# EasyEDA Pro project ByByte_nano.epro, board PCB1
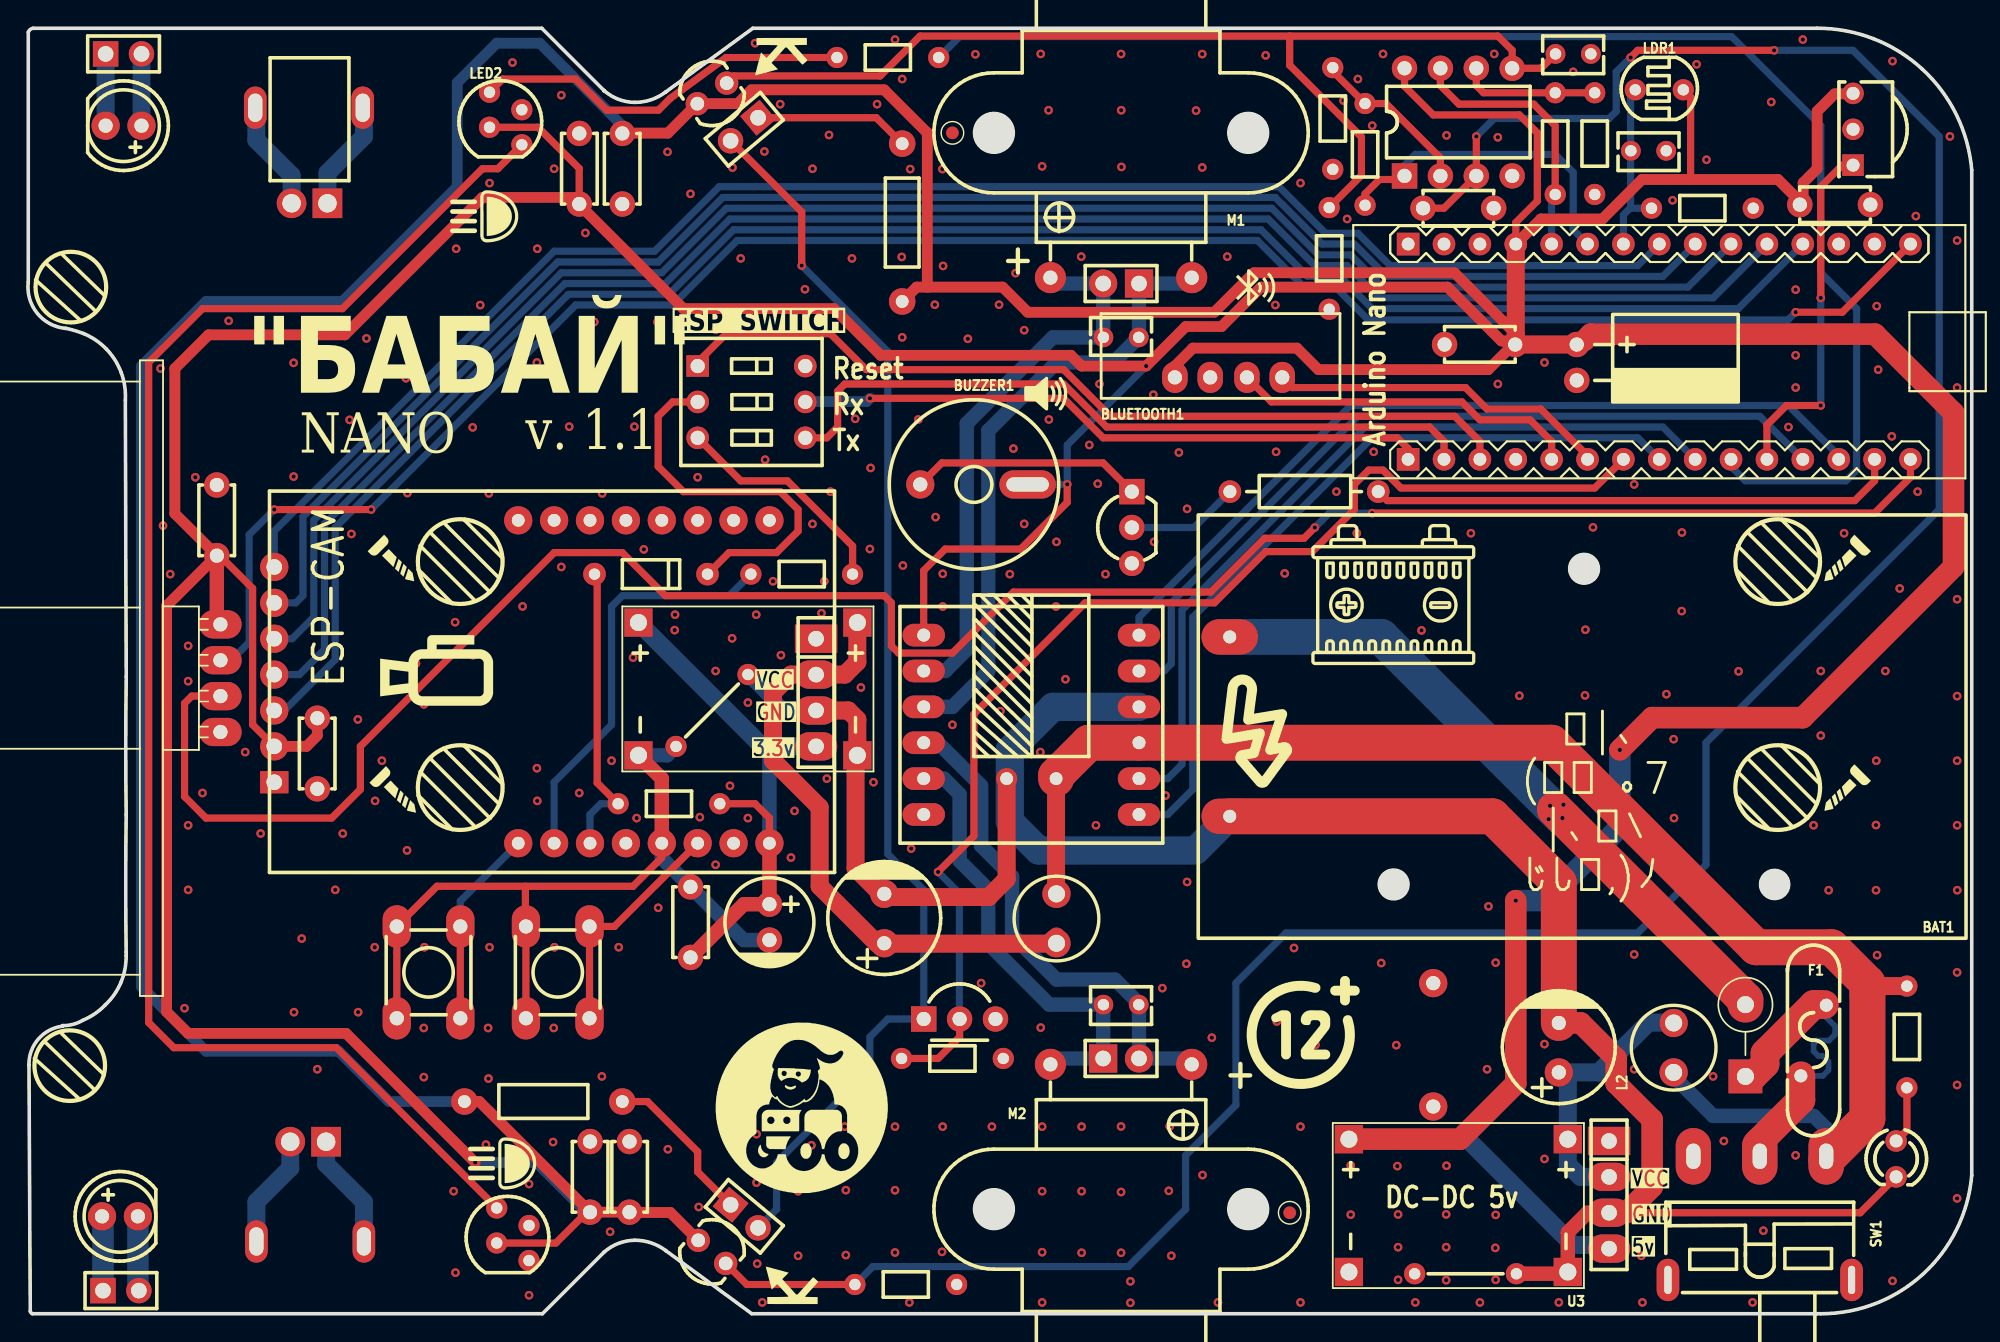
[diagram p2: board, top side]
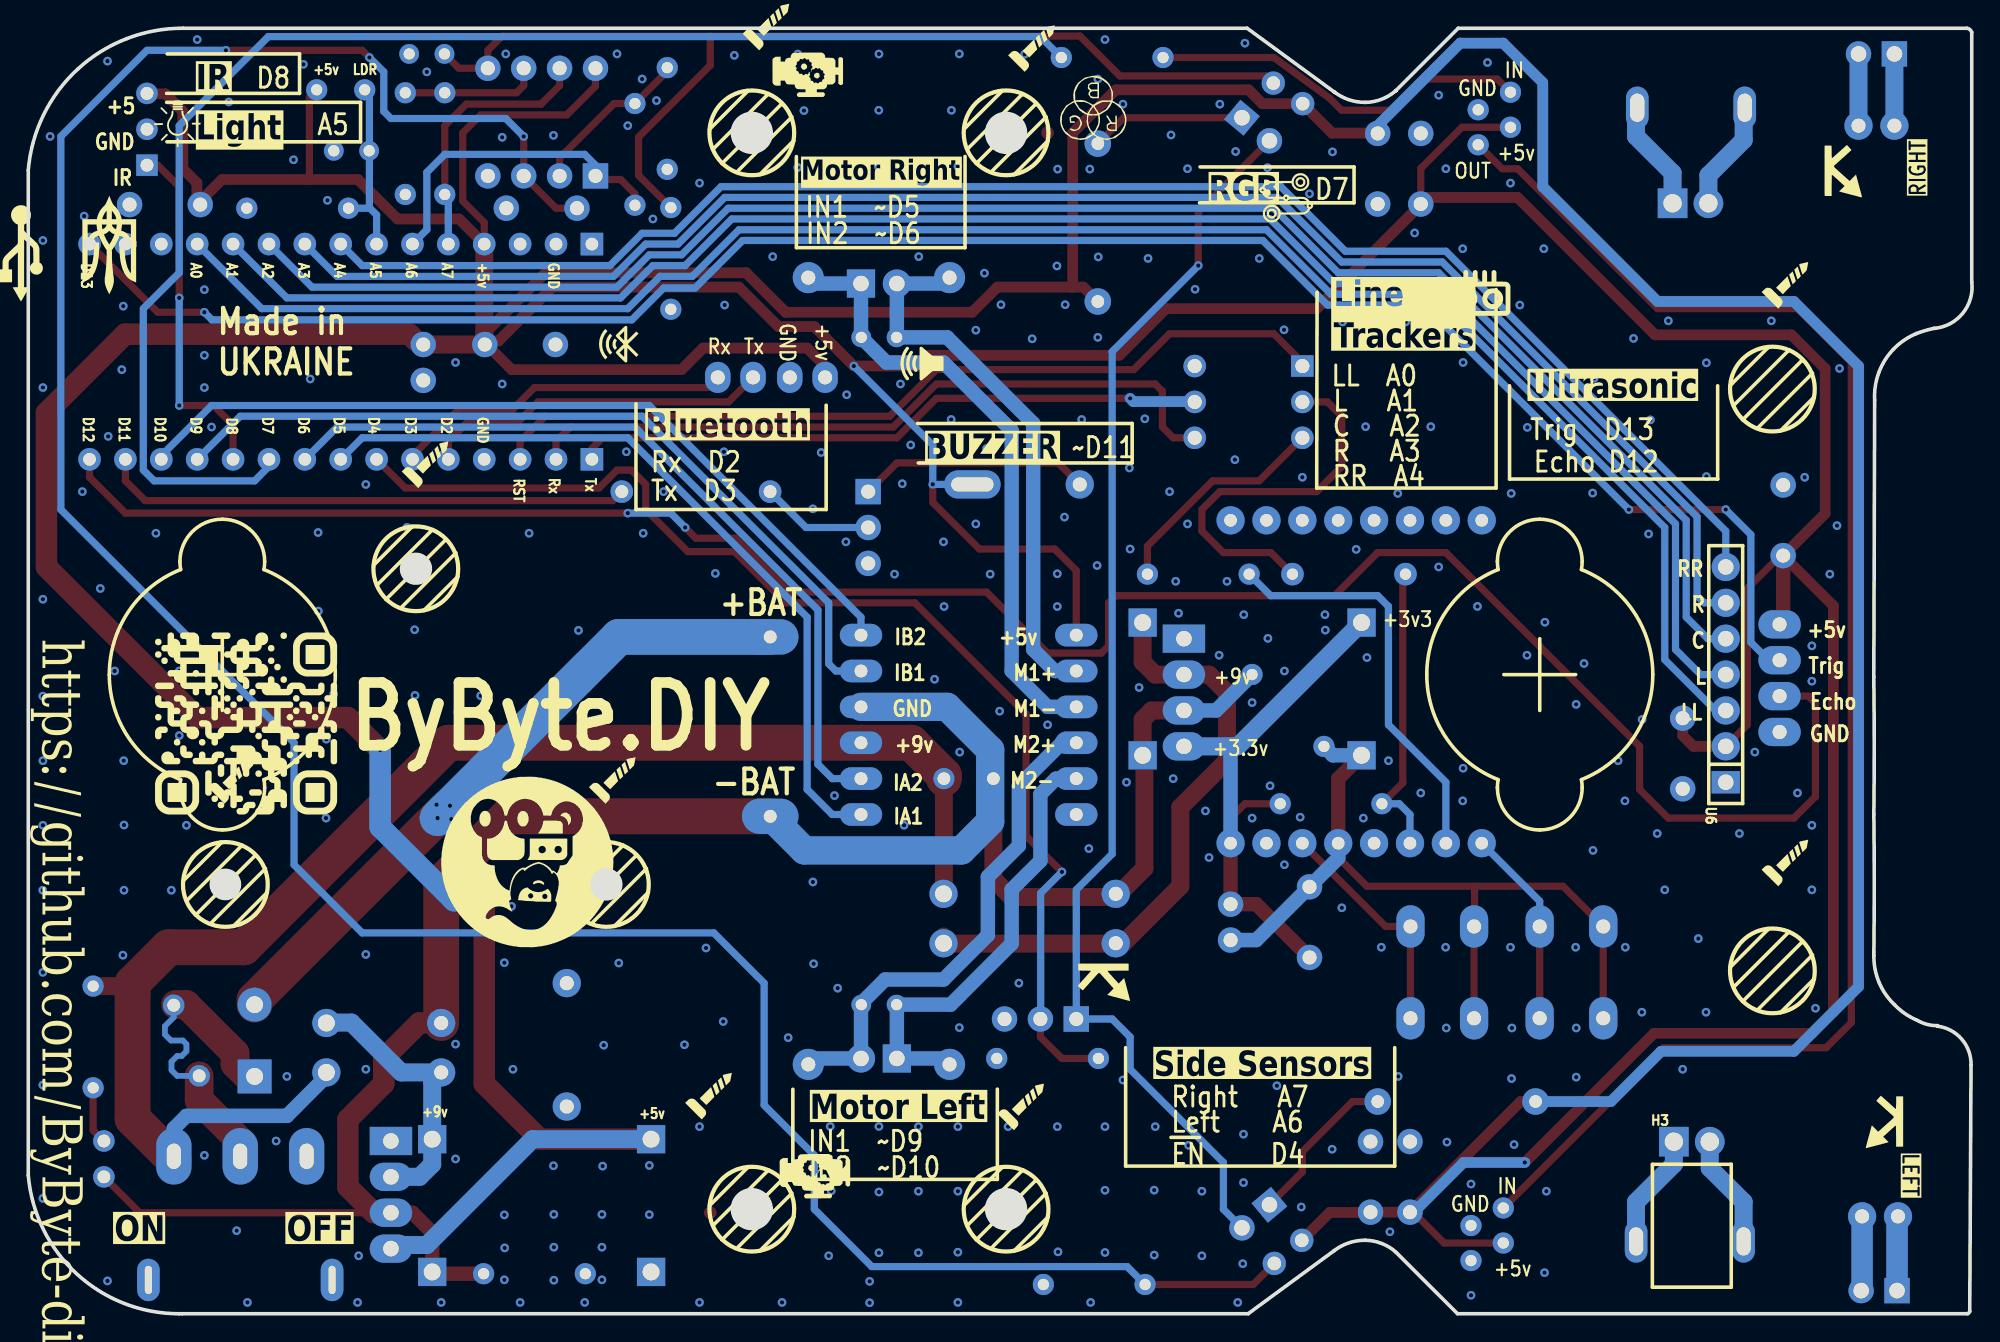
[diagram p3: board, bottom side, seen from below]

Outline 137.58 x 91.01 mm; copper layers: Top Layer, Bottom Layer. Coordinates in mm from the lower left corner of the outline.
Outline path: 40.76,86.6 40.78,86.58 arc(40.76,86.57) 40.76,86.6 ; 40.76,86.6 36.35,91.01 0.34,91.01 arc(0.13,90.91) 0,90.72 0,73.04 arc(0.62,70.85) 2.62,69.76 2.68,69.76 arc(3.31,69.6) 3.93,69.39 arc(4.79,68.92) 5.54,68.29 arc(6.15,67.51) 6.58,66.63 arc(6.83,65.67) 6.87,64.69 6.93,45.09 arc(6.91,40.22) 6.93,35.35 arc(6.9,30.48) 6.93,25.61 6.93,25.37 arc(6.85,24.4) 6.56,23.47 arc(6.1,22.61) 5.46,21.88 arc(4.71,21.24) 3.85,20.77 arc(3.16,20.49) 2.42,20.4 2.43,20.36 arc(0.71,19.44) 0.05,17.61 0.14,0.17 arc(0.2,0.07) 0.29,0 36.4,0 40.77,4.37 arc(41.77,4.98) 42.93,5.2 arc(44.09,5.02) 45.13,4.47 45.13,4.47 51.22,0 126.66,0 arc(126.78,0) 126.89,0 arc(134.14,2.82) 137.58,9.8 137.58,80.97 arc(136.49,84.88) 134.06,88.13 arc(132.44,89.36) 130.61,90.27 arc(128.65,90.83) 126.62,91.01 51.29,91.01 45.12,86.49 45.13,86.5 arc(44.08,85.95) 42.92,85.76 arc(41.77,85.99) 40.76,86.6
Stack: Top Layer 0.035mm / Dielectric1 1.51mm FR4 er 4.5 / Bottom Layer 0.035mm

## Design rules (mm)
template: JLCPCB Capability(Two Layers Board)
spacing copperThickness1oz (default): track to track 0.102, other pairs 0.152 to 0.3
spacing copperThickness2oz: track to track 0.203, other pairs 0.152 to 0.3
track width copperThickness1oz (default): min 0.127, default 0.254, max 2.54
track width copperThickness2oz: min 0.203, default 0.254, max 2.54
differential pair differentialPair (default): width min 0.127, default 0.254, max 2.54; gap min 0.152, default 0.152
via viaSize (default): diameter min 0.5, default 0.61, max 10; hole min 0.3, default 0.305, max 6.3

## Placement (name value [footprint] x y rotation side)
BAT1  -  [9V BATTERY]  109.87 41.95 180 top
BLUETOOTH1  -  [HC06]  92.85 64.81 180 top
BUZZER1  buzzer-12X9  [BUZ-TH_BD12.0-P7.60-D0.6-FD]  66.94 58.71 180 top
C1  470uF  [CAP-TH_BD8.0-P3.50-D0.6-FD-2#2]  60.59 27.98 90 top
C2  0.1u  [CAP-TH_L5.0-W2.5-P5.00-D1.0]  46.88 27.73 90 top
C3  470uF  [CAP-TH_BD6.3-P2.50-D1.0-FD]  52.47 27.73 270 top
C4  470uF  [CAP-TH_BD8.0-P3.50-D0.6-FD-2]  108.35 18.84 90 top
C5  470uF  [CAP-TH_BD6.3-P2.50-D1.0-FD]  109.62 67.35 270 top
C6  1u  [CAP-TH_L5.0-W2.5-P5.00-D1.0]  102.76 68.62 180 top
C7  1u  [CAP-TH_L5.0-W2.5-P5.00-D1.0]  42.05 81.07 270 top
C8  0.1u  [CAP-TH_L4.0-W2.5-P2.50-D0.5]  109.36 89.19 0 top
C9  1u  [CAP-TH_L5.0-W2.5-P5.00-D1.0]  42.56 9.69 90 top
C10  0.1u  [CAP-TH_L5.0-W2.5-P5.00-D1.0]  101.23 78.27 0 top
C11  1u  [CAP-TH_L5.0-W2.5-P5.00-D1.0]  13.35 56.17 270 top
C12  1u  [CAP-TH_L5.0-W2.5-P5.00-D1.0]  20.46 39.66 270 top
C13  1u  [CAP-TH_L5.0-W2.5-P5.00-D1.0]  39 81.07 90 top
C14  1u  [CAP-TH_L5.0-W2.5-P5.00-D1.0]  39.77 9.69 90 top
C15  10n  [CAP-TH_L4.0-W2.5-P2.50-D0.5]  77.36 69.13 180 top
C16  10n  [CAP-TH_L4.0-W2.5-P2.50-D0.5]  77.36 21.88 0 top
C17  470uF  [CAP-TH_BD8.0-L11.5-P3.50-D0.60]  71.01 37.89 90 top
C18  1u  [CAP-TH_L5.0-W2.5-P5.00-D1.0]  127.9 78.53 0 top
C19  0.1u  [CAP-TH_L4.0-W2.5-P2.50-D0.5]  114.7 82.34 0 top
D1  SFH4545  [LED-TH_BD5.0-P2.54-FD]  6.75 84.11 180 top
D2  SFH4545  [LED-TH_BD5.0-P2.54-FD]  6.49 6.9 0 top
D3  1N4148  [DO-35_BD2.0-L4.0-P8.0-D0.5-RD]  44.08 52.36 180 top
D4  1N5822  [Diode_THT:D_DO-15_P5.08mm_Vertical_KathodeUp]  121.55 16.8 90 top
F1  TRF250-1000  [FUSE-TH_L13.5-W3.7-P5.00-D0.8-S1.80]  126.38 19.34 270 top
H1  DCDC_3  [HDR-TH_4P-P2.54-V-F]  55.77 43.98 270 top
H2  DCDC_5  [HDR-TH_4P-P2.54-V-F]  111.9 8.42 270 top
H3  A2541HWR-2P  [HDR-TH_2P-P2.54-H-W8.7_A2541HWR-2P]  19.82 12.18 180 bottom
H4  A2541HWR-2P  [HDR-TH_2P-P2.54-H-W8.7_A2541HWR-2P]  19.91 78.62 180 top
H5  Jumper2  [HDR-TH_2P-P2.54-V-M-1#2]  77.36 18.07 0 top
H6  Jumper2  [HDR-TH_2P-P2.54-V-M-1#2]  77.36 72.94 180 top
KEY1  ESP_BOOT  [KEY-TH_4P-L6.0-W6.0-P6.50-LS4.5]  37.48 24.17 270 top
KEY2  ESP_RESET  [KEY-TH_4P-L6.0-W6.0-P6.50-LS4.5]  28.34 24.17 90 top
L1  R6H-3.0T  [TH_R6H-610-3T]  72.79 27.98 270 top
L2  R6H-3.0T  [TH_R6H-610-3T]  116.47 18.84 90 top
LDR1  -  [PHOTO_RESISTOR]  115.46 86.65 270 top
LED1  PWR  [LED-TH_BD3.0-P2.54-FD-GREEN]  132.22 10.96 270 top
LED2  WS2812B-TH  [LED-TH_4P-BD5.8_WS2812B-TH]  33.42 84.62 90 top
LED3  WS2812B-TH  [LED-TH_4P-BD5.8_WS2812B-TH]  33.92 5.63 90 top
M1  Motor_DC  [N20_DC_MOTOR 3D]  77.36 83.61 90 top
M2  Motor_DC  [N20_DC_MOTOR 3D]  77.36 7.41 270 top
Mount  -  [PROBE_PAD]  89.3 7.15 270 top
Mount1  -  [PROBE_PAD]  65.42 83.61 90 top
NOREF  -  [Pad_e254]  23.68 85.38 180 top
NOREF#2  -  [Pad_e207]  23.76 5.12 0 top
NOREF#3  -  [Pad_e75212]  99.46 23.41 180 top
NOREF#4  -  [Pad_e255]  16.07 85.38 180 top
NOREF#5  -  [Pad_e75213]  99.46 14.67 180 top
NOREF#6  -  [Pad_e208]  16.15 5.12 0 top
Q1  9014-C  [TO-92-3_L4.8-W3.7-P2.54-R]  78.12 55.67 90 top
Q2  TEFT4300  [SENSOR-TH_TEFT4300]  48.4 86.4 125 top
Q3  TEFT4300  [SENSOR-TH_TEFT4300]  48.4 4.38 50 top
Q4  BS170  [TO-92-3_L4.8-W3.7-P2.54-L]  65.93 20.87 0 top
R1  1k  [RES-TH_BD2.2-L6.5-P10.50-D0.6]  90.31 58.21 0 top
R2  1k  [RES-TH_BD1.8-L3.2-P7.20-D0.4]  132.98 19.6 90 top
R3  10k  [RES-TH_BD1.8-L3.2-P7.20-D0.4]  118.51 78.27 180 top
R4  39Ω  [R_AXIAL-0.4]  61.86 77.26 270 top
R5  39Ω  [R_AXIAL-0.4]  36.46 15.03 0 top
R6  10k  [RES-TH_BD1.8-L3.2-P7.20-D0.4]  65.42 18.07 0 top
R7  1.8k  [RES-TH_BD1.8-L3.2-P7.20-D0.4]  92.09 74.72 270 top
R8  1.8k  [RES-TH_BD1.8-L3.2-P7.20-D0.4]  62.12 2.07 0 top
R9  10k  [RES-TH_BD1.8-L3.2-P7.20-D0.4]  110.89 82.84 270 top
R10  10k  [RES-TH_BD1.8-L3.2-P7.20-D0.4]  92.34 84.62 270 top
R11  100k  [RES-TH_BD1.8-L3.2-P7.20-D0.4]  108.09 82.84 90 top
R12  100k  [RES-TH_BD1.8-L3.2-P7.20-D0.4]  94.63 82.08 90 top
R13  330  [RES-TH_BD1.8-L3.2-P7.20-D0.4]  60.85 88.94 180 top
R14  10k  [RES-TH_BD1.8-L3.2-P7.20-D0.4]  45.35 36.11 180 top
R15  100  [RES-TH_BD1.8-L3.2-P7.20-D0.4]  54.75 52.36 0 top
R16  0Ω  [RES-TH_BD1.8-L3.2-P7.20-D0.4]  101.74 2.83 180 top
R17  0Ω  [RES-TH_BD1.8-L3.2-P7.20-D0.4]  48.4 42.71 225 top
SW1  -  [SW-TH_HOOYA_SS-12D11G4]  122.57 6.9 0 top
SW2  KF1001-03P-B0-GL-DFT-01B  [SW-TH_6P-L9.9-W9.0-P2.54-LS7.6_BLUE]  51.2 64.56 270 top
U1  ARDUINO_NANO  [COMM-TH_ARDUINO_NANO]  115.46 68.11 180 top
U2  -  [DRV8833]  71.01 41.7 0 top
U3  MH-MINI-360  [DC-DC-STEP-DOWN-MP2307]  101.23 7.66 180 top
U4  MH-MINI-360  [DC-DC-STEP-DOWN-MP2307]  50.94 44.24 180 top
U5  HC-SR04  [ULTRASONIC-HC-SR04#V]  13.6 45 270 top
U6  Line Tracker  [HDR-TH_7P-P2.54-V-F]  17.41 45.25 90 bottom
U7  D38  [OPTO-TH_VS1838B]  129.17 83.86 90 top
U8  ESP32-CAM  [COMM-TH_16P-L40.0-W27.0-P2.54_ESP32-CAM]  43.58 44.74 90 top
U9  LM358AP  [DIP-8_L9.7-W6.4-P2.54-LS7.6-BL]  101.23 84.37 0 top
XP1  Jumper2  [HDR-TH_2P-P2.54-V-M-1]  6.75 89.19 0 top
XP2  Jumper2  [HDR-TH_2P-P2.54-V-M-1]  6.56 1.64 0 top
XP3  Jumper2  [HDR-TH_2P-P2.54-V-M-1]  50.69 83.86 220 top
XP4  Jumper2  [HDR-TH_2P-P2.54-V-M-1]  50.69 6.9 320 top

## Footprints (pads in the part's own frame, mm; a bottom-side part is the same pattern mirrored in y, then rotated)
9V BATTERY
  oval 4x2.5 hole 0.914: 1(24.818,-5.969) 2(24.818,6.731)
BUZ-TH_BD12.0-P7.60-D0.6-FD
  oval 4x2 hole 3x1: 1(-3.8,0)
  round 2 hole 1: 2(3.8,0)
CAP-TH_BD6.3-P2.50-D1.0-FD
  round 1.8 hole 1: 1(-1.27,0) 2(1.27,0)
CAP-TH_BD8.0-L11.5-P3.50-D0.60
  round 1.5 hole 0.9: 1(0,-1.75) 2(0,1.75)
CAP-TH_BD8.0-P3.50-D0.6-FD-2
  oval 2x2 hole 1: 1(-1.75,0)
  round 2 hole 1: 2(1.75,0)
CAP-TH_BD8.0-P3.50-D0.6-FD-2#2
  round 2 hole 1: 1(-1.75,0) 2(1.75,0)
CAP-TH_L4.0-W2.5-P2.50-D0.5
  round 1.4 hole 0.8: 1(-1.25,0) 2(1.25,0)
CAP-TH_L5.0-W2.5-P5.00-D1.0
  round 1.8 hole 1: 1(-2.5,0) 2(2.5,0)
COMM-TH_16P-L40.0-W27.0-P2.54_ESP32-CAM
  round 2 hole 0.9: 1(11.43,8.89) 2(11.43,6.35) 3(11.43,3.81) 4(11.43,1.27) 5(11.43,-1.27) 6(11.43,-3.81) 7(11.43,-6.35) 8(11.43,-8.89) 9(-11.43,-8.89) 10(-11.43,-6.35) 11(-11.43,-3.81) 12(-11.43,-1.27) 13(-11.43,1.27) 14(-11.43,3.81) 15(-11.43,6.35) 16(-11.43,8.89)
COMM-TH_ARDUINO_NANO
  rect 1.6x1.6 hole 0.9: 1(17.78,7.62) 30(17.78,-7.62)
  round 1.6 hole 0.9: 2(15.24,7.62) 3(12.7,7.62) 4(10.16,7.62) 5(7.62,7.62) 6(5.08,7.62) 7(2.54,7.62) 8(0,7.62) 9(-2.54,7.62) 10(-5.08,7.62) 11(-7.62,7.62) 12(-10.16,7.62) 13(-12.7,7.62) 14(-15.24,7.62) 15(-17.78,7.62) 16(-17.78,-7.62) 17(-15.24,-7.62) 18(-12.7,-7.62) 19(-10.16,-7.62) 20(-7.62,-7.62) 21(-5.08,-7.62) 22(-2.54,-7.62) 23(0,-7.62) 24(2.54,-7.62) 25(5.08,-7.62) 26(7.62,-7.62) 27(10.16,-7.62) 28(12.7,-7.62) 29(15.24,-7.62)
DC-DC-STEP-DOWN-MP2307
  rect 2x2 hole 1.2: IN+(-7.747,-4.699) IN-(-7.747,4.699) OUT+(7.747,-4.699) OUT-(7.747,4.699)
Diode_THT:D_DO-15_P5.08mm_Vertical_KathodeUp
  rect 2.4x2.4 hole 1.2: 1(0,0)
  round 2.4 hole 1.2: 2(5.08,0)
DIP-8_L9.7-W6.4-P2.54-LS7.6-BL
  rect 1.8x1.8 hole 1: 1(-3.81,-3.81)
  round 1.8 hole 1: 2(-1.27,-3.81) 3(1.27,-3.81) 4(3.81,-3.81) 5(3.81,3.81) 6(1.27,3.81) 7(-1.27,3.81) 8(-3.81,3.81)
DO-35_BD2.0-L4.0-P8.0-D0.5-RD
  round 1.6 hole 0.8: 1(-4,0) 2(4,0)
DRV8833
  oval 3x1.6 hole 0.914: 1(-7.62,6.35) 2(-7.62,3.81) 3(-7.62,1.27) 4(-7.62,-1.27) 5(-7.62,-3.81) 6(-7.62,-6.35) 7(7.62,-6.35) 8(7.62,-3.81) 9(7.62,-1.27) 10(7.62,1.27) 11(7.62,3.81) 12(7.62,6.35)
FUSE-TH_L13.5-W3.7-P5.00-D0.8-S1.80
  round 1.524 hole 0.914: 1(-2.5,0.9) 2(2.5,-0.9)
HC06
  oval 1.8x2.2 hole 1: 1(11.684,-1.484) 2(9.184,-1.484) 3(6.583,-1.484) 4(4.085,-1.484)
HDR-TH_2P-P2.54-H-W8.7_A2541HWR-2P
  rect 2.1x2.1 hole 1.3: 1(-1.27,0)
  round 2.1 hole 1.3: 2(1.27,0)
HDR-TH_2P-P2.54-V-M-1
  rect 1.8x1.8 hole 1.1: 1(-1.27,0)
  round 1.8 hole 1.1: 2(1.27,0)
HDR-TH_2P-P2.54-V-M-1#2
  rect 2x2 hole 1.1: 1(-1.27,0)
  round 2 hole 1.1: 2(1.27,0)
HDR-TH_4P-P2.54-V-F
  rect 2x3 hole 1.1: 1(-3.81,0)
  oval 2x3 hole 1.1: 2(-1.27,0) 3(1.27,0) 4(3.81,0)
HDR-TH_7P-P2.54-V-F
  rect 1.575x2 hole 1.1: 1(-7.62,0)
  round 2 hole 1.1: 2(-5.08,0) 3(-2.54,0) 4(0,0) 5(2.54,0) 6(5.08,0) 7(7.62,0)
KEY-TH_4P-L6.0-W6.0-P6.50-LS4.5
  oval 3x2 hole 1: 1(-3.25,2.25) 2(3.25,2.25) 3(-3.25,-2.25) 4(3.25,-2.25)
LED-TH_4P-BD5.8_WS2812B-TH
  round 1.5 hole 0.8: 1(1.86,0.762) 2(0.62,-1.524) 3(-0.62,0.762) 4(-1.86,-1.524)
LED-TH_BD3.0-P2.54-FD-GREEN
  round 1.524 hole 0.914: 1(-1.27,0) 2(1.27,0)
LED-TH_BD5.0-P2.54-FD
  round 2 hole 1: 1(-1.27,0) 2(1.27,0)
N20_DC_MOTOR 3D
  round 2.2 hole 1: 1(-10.25,5) 2(-10.25,-5)
OPTO-TH_VS1838B
  rect 1.524x1.524 hole 0.914: 1(-2.54,0)
  round 1.524 hole 0.914: 2(0,0) 3(2.54,0)
Pad_e207
  oval 1.6x3 hole 1x2: 103(0,0)
Pad_e208
  oval 1.6x3 hole 1x2: 102(0,0)
Pad_e254
  oval 1.6x3 hole 1x2: 102(0,0)
Pad_e255
  oval 1.6x3 hole 1x2: 103(0,0)
Pad_e75212
  oval 2x2 hole 1: 1(0,0)
Pad_e75213
  oval 2x2 hole 1: 2(0,0)
PHOTO_RESISTOR
  round 1.5 hole 0.8: 1(0,1.7) 2(0,-1.7)
PROBE_PAD
  round 0.9 smd: 1(0,0)
R_AXIAL-0.4
  round 1.879 hole 0.899: 1(-5.588,0) 2(5.588,0)
RES-TH_BD1.8-L3.2-P7.20-D0.4
  round 1.5 hole 0.8: 1(-3.6,0) 2(3.6,0)
RES-TH_BD2.2-L6.5-P10.50-D0.6
  round 1.6 hole 0.914: 1(-5.25,0) 2(5.25,0)
SENSOR-TH_TEFT4300
  round 1.651 hole 0.965: 1(0,1.27) 2(0,-1.27)
SW-TH_6P-L9.9-W9.0-P2.54-LS7.6_BLUE
  rect 1.524x1.6 hole 1: 1(-2.54,-3.809)
  round 1.6 hole 1: 2(0,-3.81) 3(2.54,-3.81) 4(2.54,3.81) 5(0,3.81) 6(-2.54,3.81)
SW-TH_HOOYA_SS-12D11G4
  oval 2.5x4 hole 1x1.8: 1(4.7,4.25) 2(0,4.25) 3(-4.7,4.25)
  oval 1.6x3 hole 0.5x2: 4(-6.5,-4.504) 5(6.5,-4.504)
TH_R6H-610-3T
  round 2 hole 1.2: 1(-1.75,0) 2(1.75,0)
TO-92-3_L4.8-W3.7-P2.54-L
  rect 1.8x1.8 hole 1: 1(-2.54,0)
  round 1.8 hole 1: 2(0,0) 3(2.54,0)
TO-92-3_L4.8-W3.7-P2.54-R
  rect 1.8x1.8 hole 1: 1(2.54,0)
  round 1.8 hole 1: 2(0,0) 3(-2.54,0)
ULTRASONIC-HC-SR04#V
  oval 2x3 hole 1: 1(-3.81,0) 2(-1.27,0) 3(1.27,0) 4(3.81,0)

## Nets
As in the schematic, except:
GND: BLUETOOTH1.2 C5.2 C6.2 C7.2 C8.2 C9.2 C10.2 C11.1 C12.2 C13.2 C14.2 C18.2 C19.2 LED2.2 LED3.2 NOREF#3.1 NOREF#5.2 Q1.3 Q4.3 R3.1 R6.2 R7.2 R8.2 R9.2 R10.2 R16.2 SW1.4 SW1.5 SW2.6 U1.4 U1.29 U3.OUT- U5.4 U6.1 U7.2 U8.7 U9.4

Pads without a net: H1 1; H2 1; H3 1 2; H4 1 2; LED3 4; Mount 1; Mount1 1; NOREF 102; NOREF#2 103; NOREF#4 103; NOREF#6 102; SW1 3; U1 17 18 28 30; U2 6; U8 1 2 3 4 5 6 8 10 13

## Via types
v1: diameter 0.61, hole 0.305, Top Layer to Bottom Layer, 342 vias

## Routing (per net, layer and track width the routed paths; a pad name or vN(x,y) marks a point on that pad's centre or on a via; arc(x,y) is an arc through that point)
+3.3V: length 40.4
  Top Layer w0.508: R14.1 51.45,36.11 52.47,35.09 U8.9
  Top Layer w1.016: C3.1 52.21,29 ; 52.21,29 52.47,29.25 U8.9 ; 52.21,29 50.65,29 C2.1
  Bottom Layer w1.016: U8.9 52.47,40.09 52.38,40.17
  Bottom Layer w1.27: H1.4 51.96,40.17 U4.OUT+
+5V: length 719.6
  Top Layer w0.508: U2.1 63.39,52.62 64.91,54.14 70.25,54.14 73.55,57.44 v1(73.55,58.72) ; LED2.3 36.09,84 39,81.09 39,79.03 ; LED3.3 37.35,5.01 39.51,7.17 ; 97.42,87.67 97.42,86.91 99.46,84.88 105.55,84.88 106.82,83.61 106.82,78.78 105.3,77.26 U1.27 ; U6.2 15.88,41.7 15.88,51.36 13.56,53.67 C11.2 ; LDR1.1 117.67,86.14 117.67,80.3
  Top Layer w0.762: 39,79.03 32.15,79.03 22.42,69.31 12.77,69.31 10.38,66.92 10.38,56.65 C11.2 9.79,50.12 9.79,21.38 11.32,19.85 22.49,19.85 v1(31.64,10.71) ; 63.64,72.68 63.64,83.61 60.59,86.65 51.2,86.65 50.21,85.67 Q2.1 45.28,83.59 42.05,83.59 ; 63.64,72.68 68.98,72.68 70.75,70.91 83.96,70.91 86.76,73.7 100.96,73.7 105.3,69.36 104.81,68.87 104.28,68.87 100.47,72.68 87.26,72.68 84.47,69.89 81.93,69.89 v1(79.14,67.1) 74.56,67.1 73.8,67.86 60.34,67.86 57.04,71.16 46.37,71.16 39,78.53 C13.1 ; 63.64,72.68 62.88,72.68 R4.2 ; Q3.1 45.45,7.17 42.56,7.17 ; U6.2 19.7,40.17 20.46,40.93 C12.1 ; U1.27 107.08,77.51 111.44,77.51 114.23,80.3 123.86,80.3 125.64,78.53 125.64,80.07 126.63,81.07 126.63,85.13 127.87,86.37 128.95,86.37 129.17,86.15 ; BLUETOOTH1.1 81.17,67.1 82.44,68.37 89.8,68.37 91.33,66.84 103.35,66.84 105.3,68.79 ; C9.1 C14.1 31.93,15.03 R5.1
  Top Layer w1.016: C11.2 13.35,49.06 U5.1
  Top Layer w1.27: U1.27 105.3,68.62 C5.1
  Top Layer w1.524: U3.OUT+ 101.36,12.36 105.3,16.3 v1(105.3,29.25) ; 110.15,68.9 110.6,69.35 130.73,69.35 136.29,63.79 136.29,52.87 125.62,42.2 114.95,42.2 v1(112.66,39.92)
  Bottom Layer w0.508: v1(79.14,67.1) 73.55,61.51 v1(73.55,58.72) 73.54,58.71 BUZZER1.1
  Bottom Layer w0.762: R5.1 25.54,15.03 21.99,18.58 12.59,18.58 8.02,23.15 8.02,67.1 12.59,71.67 22.24,71.67 30.37,79.8 30.37,87.16 33.16,89.96 36.21,89.96 42.05,84.11 42.05,83.59 ; 39.51,7.17 35.98,10.71 v1(31.64,10.71)
  Bottom Layer w1.27: U3.OUT+ 101.87,12.36 109.36,4.87 111.65,4.87 H2.4
  Bottom Layer w1.524: v1(112.66,39.92) 112.66,34.46 107.45,29.25 v1(105.3,29.25)
GND:
  vias: v1(9.36,66.92) v1(9.54,55.8) v1(10.05,52.36) v1(11.06,21.63) v1(11.32,47.28) v1(11.32,44.78) v1(11.32,34.58) v1(11.32,30.01) v1(11.83,59.22) v1(12.33,36.87) v1(14.19,70.3) v1(15.36,39.77) v1(16.45,34) v1(18.79,67.32) v1(18.79,59.27) v1(18.81,21.35) v1(19.36,26.56) v1(20.46,17.31) v1(21.48,70.3) v1(21.73,30.01) v1(22.27,34) v1(22.75,63.29) v1(22.88,55.21) v1(23.33,42.08) v1(23.35,21.35) v1(23.94,69.05) v1(24.53,25.95) v1(24.55,36.31) v1(25.03,39.16) v1(26.74,66.23) v1(26.84,58.1) v1(26.81,32.81) v1(27.45,46.04) v1(28.01,43.14) v1(28.04,25.95) v1(28,20.23) v1(28,16.75) v1(30.11,8.68) v1(30.22,48.96) v1(30.24,2.91) v1(30.29,75.4) v1(31.46,62.75) v1(31.49,46.62) v1(31.99,71.41) v1(32.4,11.98) v1(32.6,58.08) v1(32.55,20.23) v1(32.58,16.65) v1(32.65,80.05) v1(32.65,25.95) v1(34.28,88.58) v1(34.99,50.08) v1(35.45,9.18) v1(35.45,1.31) v1(36.03,75.4) v1(36.01,67.35) v1(36.01,38.62) v1(36.03,36.31) v1(37.23,81.07) v1(37.24,25.95) v1(37.2,20.23) v1(37.15,12.16) v1(37.73,86.27) v1(37.73,52.87) v1(38.29,62.8) v1(39,36.87) v1(39.44,76.52) v1(40.07,70.22) v1(40.63,58.08) v1(40.6,16.8) v1(41.19,5.81) v1(41.29,39.16) v1(41.8,25.95) v1(42.81,46.45) v1(42.91,62.8) v1(43.07,35.09) v1(43.58,54.12) v1(44.54,70.22) v1(44.59,28.74) v1(45.25,82.26) v1(45.28,11.65) v1(45.79,49.49) v1(45.76,48.4) v1(46.88,79.29) v1(47.39,59.22) v1(47.54,35.16) v1(47.46,7.56) v1(48.68,69.66) v1(48.66,45.51) v1(48.66,31.79) v1(49.19,16.14) v1(49.67,37.38) v1(49.85,81.14) v1(49.82,47.82) v1(50.43,74.72) v1(50.94,43.27) v1(50.94,35.09) v1(51.45,89.96) v1(51.53,49.49) v1(51.55,12.71) v1(51.55,9.28) v1(51.6,3.54) v1(51.96,0.8) v1(52.11,82.28) v1(52.16,60.47) v1(52.72,51.86) v1(53.23,85.64) v1(53.28,46.62) v1(53.99,32.3) v1(54.24,35.6) v1(54.5,8.68) v1(54.5,4.1) v1(54.98,72.53) v1(55.44,11.93) v1(55.51,81.07) v1(55.51,55.92) v1(56.15,49.59) v1(56.35,51.86) v1(56.53,37.89) v1(56.68,83.45) v1(56.78,58.21) v1(57.8,13.25) v1(57.88,8.75) v1(57.88,4.15) v1(58.31,74.72) v1(58.54,63.36) v1(58.94,44.34) v1(59.63,59.88) v1(59.58,54.14) v1(59.83,37.63) v1(60.09,85.64) v1(60.09,16.55) v1(61.36,90.21) v1(61.36,13.25) v1(61.36,8.74) v1(61.36,4.34) v1(61.83,74.82) v1(61.86,87.42) v1(61.86,69.13) v1(61.91,52.97) v1(62.43,81.04) v1(62.37,0.8) v1(62.5,32.93) v1(63.01,63.31) v1(64.18,71.44) v1(64.23,56.4) v1(64.71,81.04) v1(64.73,52.39) v1(64.73,50.07) v1(64.73,13.25) v1(64.68,4.38) v1(64.76,74.18) v1(65.42,41.7) v1(66.51,69.03) v1(67.05,89.17) v1(67.45,23.41) v1(68.21,13.25) v1(68.72,71.44) v1(68.81,42.66) v1(69.48,52.36) v1(69.74,61.25) v1(69.89,73.67) v1(70.5,69.64) v1(70.5,55.92) v1(71.64,39.77) v1(71.67,89.19) v1(71.67,20.26) v1(71.77,81.23) v1(71.77,13.25) v1(71.77,8.68) v1(71.77,4.36) v1(71.77,0.8) v1(72.23,85.21) v1(72.25,63.31) v1(72.75,50.07) v1(72.79,54.65) v1(73.42,44.92) v1(74.54,74.84) v1(74.56,13.25) v1(74.56,8.68) v1(74.56,4.32) v1(75.11,61.51) v1(75.58,34.58) v1(75.71,58.76) v1(75.83,65.83) v1(76.25,52.36) v1(77.36,89.19) v1(77.37,85.21) v1(77.38,81.19) v1(77.36,13.26) v1(77.36,8.62) v1(77.36,4.32) v1(78.02,2.3) v1(78.02,0.78) v1(79.64,65.06) v1(79.69,54.65) v1(80.28,23.05) v1(80.5,36.69) v1(80.74,8.7) v1(80.81,13.26) v1(80.91,4.1) v1(81.45,60.97) v1(82.03,56.99) v1(82.03,30.57) v1(81.98,24.78) v1(82.67,85.18) v1(83.1,89.18) v1(83.1,81.16) v1(83.12,9.82) v1(83.78,19.55) v1(84.22,0.8) v1(84.88,74.84) v1(87.59,89.09) v1(88.28,71.41) v1(88.33,61.03) v1(88.38,20.69) v1(88.94,52.41) v1(89.6,25.9) v1(90.06,80.05) v1(90.06,13.25) v1(90.06,0.8) v1(91.12,19.04) v1(92.6,58.21) v1(93.11,85.89) v1(93.36,77.51) v1(93.61,10.5) v1(93.61,7.02) v1(94.05,55.26) v1(94.12,87.42) v1(95.14,84.11) v1(95.24,61.03) v1(95.77,24.83) v1(95.9,89.19) v1(96.84,19.01) v1(96.92,10.45) v1(96.97,7.03) v1(96.97,4.71) v1(96.97,2.4) v1(98.19,0.8) v1(98.63,48.38) v1(100.4,83.43) v1(100.4,10.48) v1(100.37,7.04) v1(100.37,4.71) v1(100.37,2.38) v1(102.12,55.26) v1(102.76,0.8) v1(103.27,17.31) v1(103.37,28.84) v1(103.77,89.19) v1(103.85,4.66) v1(103.88,24.86) v1(103.88,7) v1(103.88,2.4) v1(104.03,83.29) v1(104.03,65.83) v1(105.55,43.75) v1(107.33,67.35) v1(107.33,19.09) v1(107.33,10.96) v1(108.35,0.8) v1(109.36,87.92) v1(110.23,48.43) v1(110.2,43.78) v1(110.76,55.68) v1(113.68,58.71) v1(113.68,25.44) v1(113.68,17.31) v1(114.19,4.1) v1(114.27,0.8) v1(115.96,43.86) v1(116.4,78.83) v1(116.47,40.68) v1(116.5,35.09) v1(117.04,49.75) v1(117.06,55.31) v1(117.62,66.18) v1(118.1,88.46) v1(118.8,81.7) v1(119.27,16.8) v1(120.03,12.23) v1(121.07,45.48) v1(122.06,0.8) v1(122.82,5.88) v1(123.38,85.79) v1(124.6,62.78) v1(125.11,72.5) v1(125.11,67.86) v1(125.11,65.57) v1(125.11,11.22) v1(125.62,90.21) v1(126.38,34.58) v1(126.89,45.51) v1(126.89,40.93) v1(127.45,29.99) v1(128.54,55.26) v1(130.82,39.16) v1(130.8,34.6) v1(130.8,29.99) v1(130.85,71.34) v1(130.88,25.39) v1(130.95,66.84) v1(131.46,45.51) v1(131.92,62.12) v1(131.97,88.69) v1(131.97,2.33) v1(132.48,51.35) v1(133.62,77.71) v1(133.75,58.21) v1(136.03,83.35) v1(136.54,75.99) v1(136.54,65.57) v1(136.54,50.59) v1(136.54,43.73) v1(136.54,39.16) v1(136.54,34.58) v1(136.54,24.17) v1(136.54,16.19) v1(136.54,8.17) v1(136.55,29.99)
PGND: length 154.9
  Top Layer w0.508: LED1.2 129.68,7.15 113.12,7.15
  Top Layer w1.016: H2.3 110.38,7.15 108.98,5.75 U3.IN- 108.85,2.83 R16.1
  Top Layer w1.27: C17.2 69.26,30.77 67.99,29.5 60.59,29.5 58.56,31.54 58.56,39.41 58.69,39.54 58.69,42.08 58.05,42.71 H1.3
  Top Layer w1.524: C4.2 109.9,20.59 112.41,18.07 112.41,16.3 114.95,13.76 114.95,8.98 113.12,7.15
  Top Layer w2.54: BAT1.2 103.65,35.22 108.35,30.52 C4.2
  Bottom Layer w1.016: R17.1 53.49,42.71 H1.3
  Bottom Layer w2: BAT1.2 82.64,32.81 71.52,32.81 69.48,34.84 69.48,39.92 72.53,42.97 U2.10
VCC: length 105.3
  Top Layer w1.27: 72.79,30.24 72.76,30.24 C17.1 ; 130.19,22.59 130.8,23.2 R2.2
  Top Layer w2.54: C17.1 72.76,38.11 75.07,40.43 U2.9 107.84,40.43 122.32,25.95 127.65,25.95 130.19,23.41 130.19,13.81 127.27,10.89
  Bottom Layer w1.016: 116.22,17.34 116.22,17.06 119.27,14.01 126.38,14.01 127.27,13.12 127.27,10.89
(no net): length 31.1
  Bottom Layer w1.27: 23.76,5.38 23.76,7.91 21.09,10.59 H3.1 ; 23.76,85.04 23.76,83.35 21.18,80.77 H4.1 ; NOREF#6.102 16.15,7.92 18.55,10.31 H3.2 ; 16.14,85.2 16.14,83.1 18.64,80.6 H4.2
BT_RX: length 24.7
  Top Layer w0.508: U1.5 107.84,61.76 106.31,63.29 102.76,63.29 101.49,64.56 88.01,64.56 BLUETOOTH1.3
BT_TX: length 24.2
  Top Layer w0.508: BLUETOOTH1.4 89.49,65.57 101.74,65.57 103.27,64.05 107.08,64.05 110.38,60.75 U1.6
BUZZ: length 37.5
  Top Layer w0.508: U1.14 130.7,58.97 129.3,57.57 96.2,57.57 R1.2
ESP_GND: length 58.6
  Top Layer w0.508: 35.19,30.27 35.19,27.46 KEY1.3 KEY1.4 ; 35.19,30.27 42.81,30.27 44.85,32.3 U8.12 ; 35.19,30.27 28.93,30.27 KEY2.2 KEY2.1
  Top Layer w1.016: U4.OUT- 44.85,37.89 U8.12
  Bottom Layer w1.016: U4.OUT- 45.23,39.54 R17.2 ; C3.2 50.65,26.46 C2.2 44.85,32.26 U8.12
ESP_RX: length 27.1
  Top Layer w0.508: SW2.2 45.61,64.56 44.59,63.54 44.59,59.98 46.37,58.21 53.23,58.21 54.5,56.94 54.5,55.41 52.97,53.89 49.61,53.89 D3.1
ESP_TX: length 16.1
  Top Layer w0.508: R15.2 58.35,54.35 53.74,58.97 50.43,58.97 SW2.3
IR: length 25.2
  Top Layer w0.508: U1.11 123.08,62.93 124.45,64.3 v1(126.89,64.3) ; U7.1 128.41,81.32 126.89,79.8 v1(126.89,71.92)
  Bottom Layer w0.508: v1(126.89,64.3) v1(126.89,71.92)
LIGHT: length 12.8
  Bottom Layer w0.508: 113.43,78.31 112.92,77.8 U1.24 ; 113.43,78.31 113.43,86.32 LDR1.2 ; 113.43,78.31 113.46,78.27 R3.2
LINE_C: length 123.3
  Bottom Layer w0.508: U6.5 18.68,47.79 20.21,49.32 20.21,56.17 37.73,73.7 44.85,73.7 49.42,78.27 88.03,78.27 91.33,74.97 93.61,74.97 95.9,72.68 117.49,72.68 U1.21
LINE_L: length 128.1
  Bottom Layer w0.508: U1.20 119.27,71.92 95.65,71.92 93.36,74.21 91.07,74.21 87.77,77.51 49.67,77.51 45.1,72.94 37.99,72.94 20.97,55.92 20.97,47.03 19.19,45.25 U6.4
LINE_LL: length 132
  Bottom Layer w0.508: U6.3 18.13,42.71 21.73,46.31 21.73,55.67 38.24,72.18 45.35,72.18 49.93,76.75 87.26,76.75 90.57,73.45 92.85,73.45 95.14,71.16 121.05,71.16 U1.19
LINE_R: length 119
  Bottom Layer w0.508: U6.6 18.94,50.33 19.45,50.84 19.45,56.43 37.48,74.46 44.59,74.46 49.16,79.03 88.28,79.03 91.58,75.73 93.87,75.73 96.15,73.45 115.71,73.45 U1.22
LINE_RR: length 113.6
  Bottom Layer w0.508: U6.7 17.41,55.41 37.23,75.22 44.34,75.22 48.91,79.8 88.53,79.8 91.84,76.49 94.12,76.49 96.41,74.21 113.93,74.21 U1.23
M1_IN1: length 55.7
  Bottom Layer w0.508: U2.7 80.66,35.35 82.44,37.12 82.44,49.32 95.14,62.02 113.93,62.02 U1.8
M1_IN2: length 57
  Bottom Layer w0.508: U1.9 115.71,62.78 94.63,62.78 81.68,49.82 81.68,38.9 80.66,37.89 U2.8
M2_IN1: length 58.3
  Bottom Layer w0.508: U2.11 80.41,45.51 80.91,46.01 80.91,50.33 94.12,63.54 122.57,63.54 U1.12
M2_IN2: length 58.7
  Bottom Layer w0.508: U1.13 128.16,60.75 124.6,64.3 93.61,64.3 78.63,49.32 U2.12
SIDE_L: length 23.7
  Top Layer w0.508: 97.42,80.05 97.17,80.3 95.65,80.3 94.63,79.29 R12.1
  Bottom Layer w0.508: 97.42,80.05 97.42,81.32 98.19,82.08 108.09,82.08 109.36,80.81 109.36,76.75 U1.25
SIDE_R: length 19
  Top Layer w0.508: 99.96,87.67 99.96,86.95 101.28,85.64 106.57,85.64 108.09,84.11 R11.1
  Bottom Layer w0.508: U1.26 107.84,78.99 R11.1 108.09,79.75
SONAR_ECHO: length 152.9
  Top Layer w0.508: v1(95.14,56.68) 130.7,56.68 133.24,59.22 U1.15 ; U5.3 11.57,43.73 11.06,43.22 11.06,36.62 12.59,35.09 21.48,35.09 23.51,37.12 23.51,40.17 37.23,53.89 42.05,53.89 45.1,50.84 60.59,50.84 61.1,50.33 61.1,47.28 61.61,46.78 65.42,46.78 69.74,51.09 83.71,51.09 87.52,54.9 90.31,54.9 v1(91.07,55.67)
  Bottom Layer w0.508: v1(91.07,55.67) 92.09,56.68 v1(95.14,56.68)
SONAR_TRIG: length 141
  Top Layer w0.508: U1.16 128.41,70.91 v1(125.11,70.91) ; v1(17.41,56.94) v1(24.27,56.94)
  Bottom Layer w0.508: U5.2 14.37,46.27 15.64,47.54 15.64,55.16 v1(17.41,56.94) ; v1(125.11,70.91) 124.57,70.37 94.85,70.37 92.6,72.62 90.38,72.62 87.01,75.99 50.18,75.99 45.61,71.41 38.75,71.41 v1(24.27,56.94)
WS2812: length 101.2
  Bottom Layer w0.508: U1.10 120.54,59.98 121.55,58.97 128.67,58.97 129.43,59.73 129.43,71.16 126.89,73.7 126.89,84.11 120.58,90.42 65.93,90.42 R13.1
~SIDE_EN: length 85.3
  Top Layer w0.508: v1(64.4,31.28) 66.94,33.82 66.94,42.46 74.82,50.33 83.96,50.33 87.59,53.96 90.89,53.96 93.87,56.94 93.87,58.71 94.88,59.73 95.9,59.73 97.17,58.46 110.89,58.46 U1.7 ; 61.31,18.07 64.4,18.07 65.93,19.6 Q4.2
  Bottom Layer w0.508: v1(64.4,31.28) 65.91,29.77 65.91,20.88 Q4.2
$1N1464: length 8
  Bottom Layer w0.508: R1.1 82.52,55.67 Q1.2
$1N1467: length 16.4
  Top Layer w0.508: Q1.1 76.09,60.24 64.67,60.24 BUZZER1.2
$1N1626: length 27.2
  Top Layer w0.508: R13.2 49.4,88.94 45.45,86.05 44.61,85.21 40.96,85.21 38.75,87.42 33.59,87.42 LED2.1
$1N1633: length 109.6
  Top Layer w0.508: LED2.4 33.24,81.07 32.15,81.07 22.24,71.16 12.33,71.16 8.52,67.35 8.52,20.61 10.3,18.84 21.81,18.84 LED3.1
$1N4176: length 4.1
  Top Layer w0.508: R2.1 132.98,12.99 LED1.1
$1N4272: length 39.6
  Bottom Layer w1.016: U2.2 64.91,45.51 66.44,47.03 66.44,63.03 72.53,69.13 C15.2 76.09,69.15 H6.2 72.78,72.94 M1.1
$1N4279: length 43.7
  Bottom Layer w1.016: M1.2 81.94,72.94 H6.1 78.63,69.15 C15.1 76.83,67.35 72.79,67.35 67.96,62.52 67.96,45.51 65.42,42.97 U2.3
$1N5405: length 5.1
  Bottom Layer w1.27: XP1.1 D1.2
$1N5529: length 5.3
  Bottom Layer w1.524: D2.1 5.29,6.83 XP2.1
$1N7817: length 60.9
  Top Layer w0.508: SW2.1 47.39,67.36 49.41,69.38 56.78,69.38 59.32,66.84 73.29,66.84 76.6,63.54 100.98,63.54 102.76,61.76 U1.3
$1N8038: length 21.3
  Top Layer w0.508: R14.2 40.27,37.59 40.27,52.17 D3.2
  Bottom Layer w0.508: U8.14 39.77,35.35 40.53,36.11 R14.2
$1N8431: length 16.6
  Top Layer w0.508: U8.11 41.49,27.42 KEY1.1 KEY1.2
$1N8535: length 14.1
  Top Layer w0.508: KEY2.4 KEY2.3
  Bottom Layer w0.508: U8.16 30.59,29.21 KEY2.4
$1N9044: length 35.6
  Bottom Layer w1.016: M2.1 81.94,18.07 H5.2 78.63,21.86 C16.2 78.61,21.98 76.93,23.66 72.79,23.66 69.65,26.8 69.65,30.94 67.45,33.14 67.45,37.38 64.4,40.43 U2.4
$1N9105: length 32.1
  Bottom Layer w1.016: M2.2 72.78,18.07 H5.1 76.09,21.86 C16.1 72.28,21.88 67.96,26.2 67.96,30.03 65.93,32.06 65.93,36.78 64.82,37.89 U2.5
$1N12441: length 29.3
  Bottom Layer w0.508: R15.1 49.63,50.84 42.05,50.84 41.29,50.08 41.29,41.7 37.23,37.63 U8.15
$1N12605: length 51.2
  Top Layer w0.508: U1.2 100.22,61.76 99.2,62.78 76.34,62.78 73.29,65.83 57.8,65.83 57.29,65.32 57.29,62.78 56.53,62.02 SW2.4
$1N12810: length 24
  Top Layer w2.032: 122.57,10.89 122.57,12.22 125.48,15.13 F1.2 ; 127.15,21.89 126.39,21.89 122.94,18.45 122.94,17.68 122.06,16.8 D4.1
  Bottom Layer w0.4: F1.1 127.28,20.98 127.9,20.36 127.9,19.78 127.47,19.34 126.63,19.34 126.38,19.09 126.38,18.58 126.71,18.25 127.04,18.25 127.44,17.85 127.44,17.24 127.04,16.84 F1.2
$1N12946: length 48.3
  Top Layer w2.54: 108.07,35.71 121.55,22.23 D4.2
  Bottom Layer w2.54: v1(108.6,35.09) v1(107.72,35.97) 95.77,47.92 85.05,47.92
  vias: v1(107.62,35.01) v1(108.68,36.04)
$1N16301: length 5.1
  Bottom Layer w1.27: XP1.2 D1.1
$1N16307: length 5.3
  Bottom Layer w1.524: D2.2 7.76,1.71 XP2.2
$1N16316: length 88.8
  Top Layer w0.508: v1(54.75,74.21) 54.75,78.01 XP3.2
  Bottom Layer w0.508: v1(54.75,74.21) 60.85,68.11 60.85,32.55 63.39,30.01 63.39,21.12 63.13,20.87 60.85,20.87 59.58,19.6 59.58,17.31 52.97,10.71 52.97,7.39 XP4.2
$1N16464: length 11
  Top Layer w0.508: XP3.1 60.03,84.68 R4.1
$1N16512: length 11.5
  Top Layer w0.508: XP4.1 47.39,10.04 47.39,11.47 43.83,15.03 R5.2
$1N23882: length 195
  Top Layer w0.508: R8.1 50.86,2.07 Q3.2 ; C10.1 100.22,78.27 U9.3 v1(102.5,83.35) ; v1(113.43,88.94) 113.93,89.45 v1(123.59,89.45)
  Bottom Layer w0.508: v1(123.59,89.45) 129.17,89.45 135.27,83.35 135.27,56.94 118.76,40.43 118.76,31.79 113.93,26.96 89.04,26.96 85.49,23.41 85.49,14.77 81.93,11.22 81.93,7.41 77.87,3.34 59.79,3.34 R8.1 ; v1(102.5,83.35) 103.77,84.62 111.9,84.62 112.41,85.13 112.41,87.92 v1(113.43,88.94)
$1N23884: length 77.4
  Top Layer w0.508: 89.3,90.46 63.13,90.46 60.31,87.64 49.95,87.64 Q2.2 ; 89.3,90.46 104.03,90.46 105.04,89.45 U9.5 107.1,88.18 C8.1 ; 89.3,90.46 89.3,88.39 94.38,83.31 94.38,80.6 R7.1
$1N23924: length 12.2
  Top Layer w0.508: R10.1 92.34,87.97 R12.2 96.11,85.68 99.96,81.83 99.96,80.05
$1N24128: length 9.3
  Top Layer w0.508: R9.1 R11.2 103.01,86.44 102.5,86.95 102.5,87.67
$1N26344: length 19.5
  Bottom Layer w1.27: H2.2 109.87,9.69 108.98,10.58 U3.IN+ 108.98,16.45 C4.1 111.17,17.09 114.7,20.61 115.94,20.61 116.22,20.34
$1N41219: length 43.4
  Top Layer w1.27: 72.79,26.71 72.28,26.2 60.09,26.2 56.02,30.27 56.02,35.85 52.72,39.16 52.72,43.98 53.99,45.25 H1.2 57.8,45.25 58.69,46.14 58.69,48.93
$1N41760: length 45
  Top Layer w0.508: U1.1 97.68,61.25 96.92,62.02 76.09,62.02 73.29,64.81 v1(59.58,64.81)
  Bottom Layer w0.762: SW2.5 55.26,64.56 55.29,64.58 59.35,64.58 v1(59.58,64.81)

## Copper pours and planes (outline as drawn; the poured copper is in the pictures)
GND on Top Layer: -1.13,90.93 137.56,90.93 137.56,0.04 -1.13,0.04
GND on Bottom Layer: -1.44,91.01 137.56,91.01 137.56,-0.21 -1.44,-0.21

## Text on the board
Bottom Silkscreen Layer: Tx | Rx | GND | RST | +5v | A7 | D2 | A6 | D3 | A5 | D4 | A4 | D5 | A3 | D6 | A2 | D7 | A1 | D8 | A0 | D9 | D10 | D11 | D12 | D13 | +9v | LDR | IN | OUT | +3v3 | +3.3v | RIGHT | LEFT | Echo | Trig | L | R | C | LL | RR | M1- | M1+ | M2+ | M2- | IB2 | IB1 | IA1 | IA2 | IR | +5 | Rx  D2 | Tx  D3 | Echo D12 | Trig  D13 | L   A1 | C   A2 | R   A3 | RR  A4 | LL  A0 | Right   A7 | Left    A6 | EN     D4 | ~D11 | IN2  ~D10 | IN1  ~D9 | IN2  ~D6 | IN1  ~D5 | +BAT | -BAT | Made in / UKRAINE | ByByte.DIY | https://github.com/ByByte-diy | Motor Right | Ultrasonic | Line / Trackers | RGB | Side Sensors | BUZZER | Motor Left | Bluetooth | Light | OFF | ON
Top Silkscreen Layer: 3.3v | VCC | GND | 5v | Arduino Nano | Reset | Rx | Tx | DC-DC 5v | ESP-CAM | + | v. 1.1 | NANO | ESP  SWITCH | ╱|、 / (˚ˎ 。7 / |、˜〵 / じしˍ,)ノ | "БАБАЙ"
